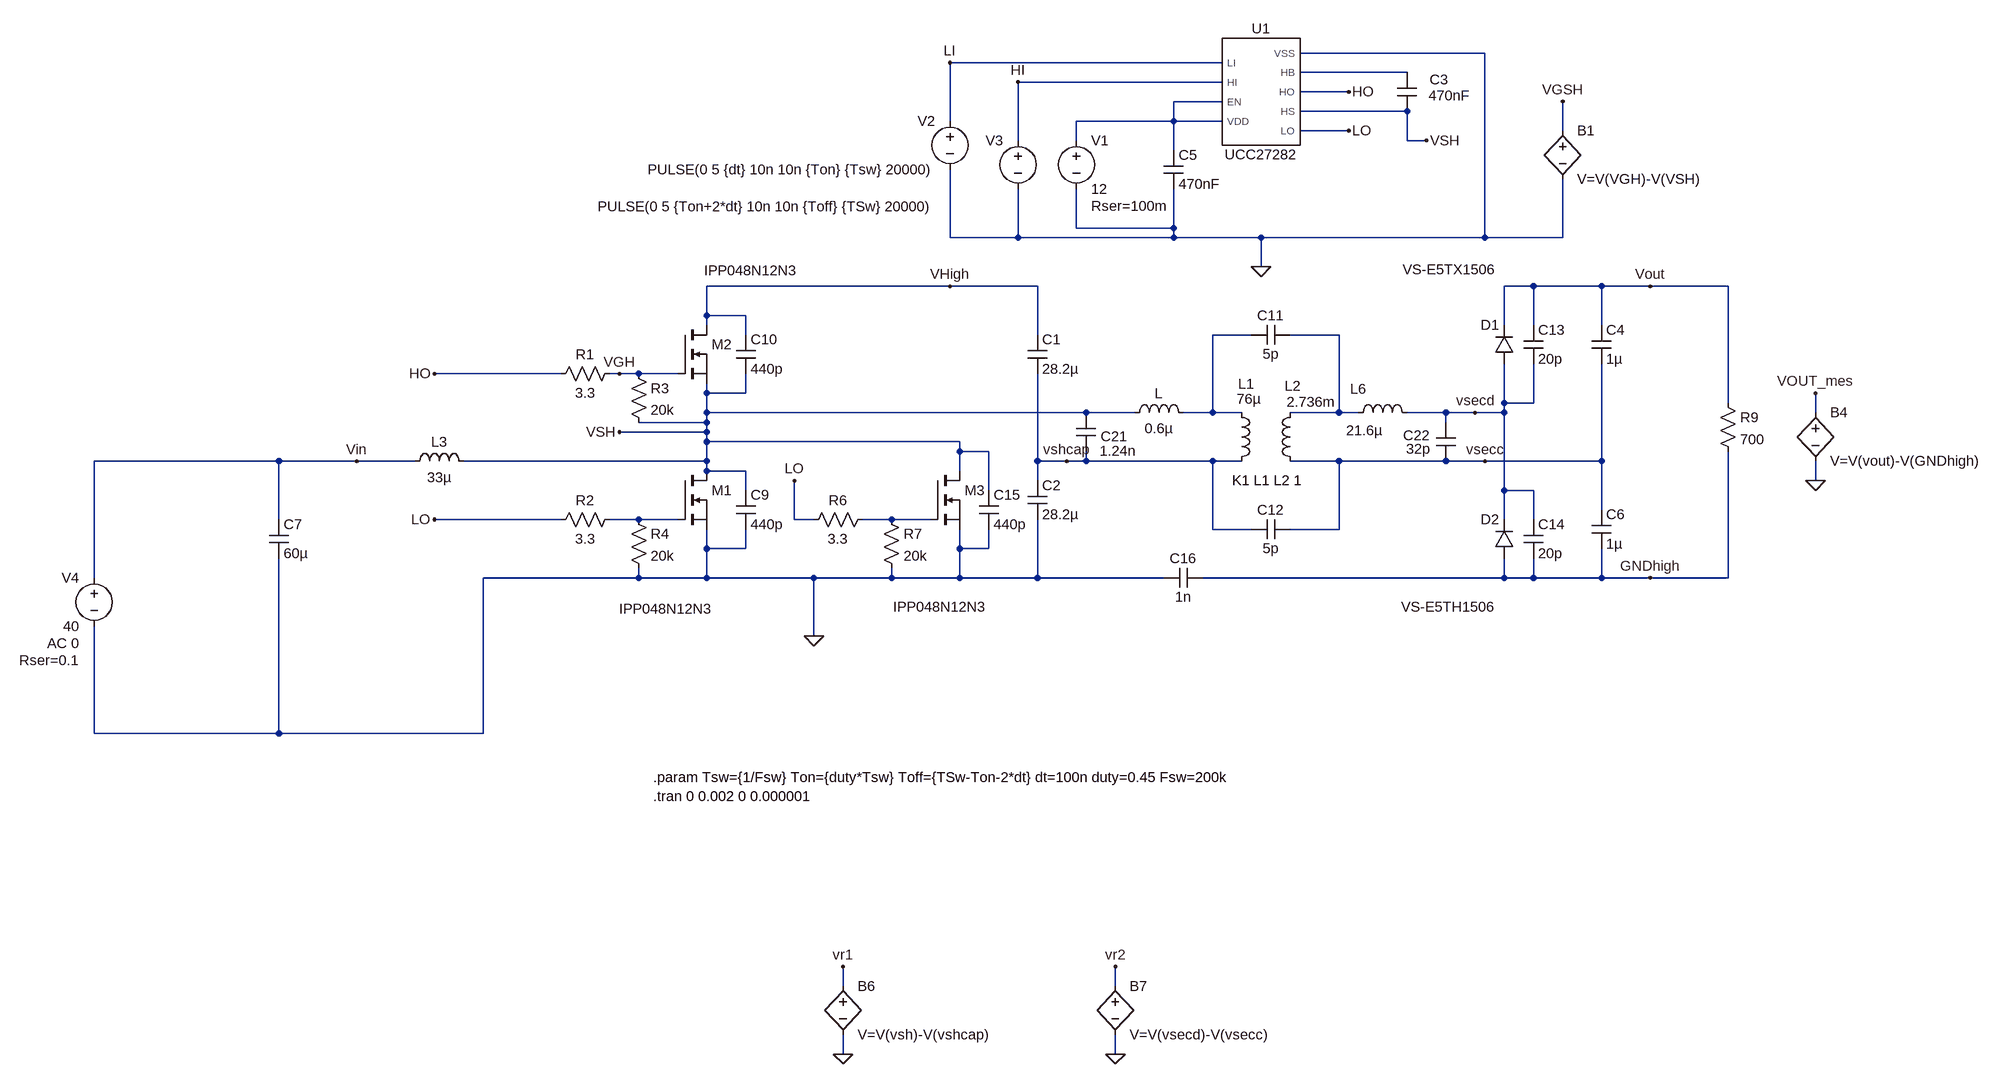
[diagram p0: schematic Current_Fed_Half_Bridge.asc]
Current_Fed_Half_Bridge.asc, the LTspice schematic file:
Version 4.1
SHEET 1 2312 1124
WIRE 1472 -544 1168 -544
WIRE 1040 -528 592 -528
WIRE 1344 -512 1168 -512
WIRE 1040 -496 704 -496
WIRE 1248 -480 1168 -480
WIRE 1040 -464 960 -464
WIRE 1344 -448 1168 -448
WIRE 592 -432 592 -528
WIRE 960 -432 960 -464
WIRE 960 -432 800 -432
WIRE 1040 -432 960 -432
WIRE 1248 -416 1168 -416
WIRE 1600 -416 1600 -464
WIRE 704 -400 704 -496
WIRE 800 -400 800 -432
WIRE 1344 -400 1344 -448
WIRE 1376 -400 1344 -400
WIRE 960 -384 960 -432
WIRE 800 -256 800 -320
WIRE 960 -256 960 -320
WIRE 960 -256 800 -256
WIRE 592 -240 592 -352
WIRE 704 -240 704 -320
WIRE 704 -240 592 -240
WIRE 960 -240 960 -256
WIRE 960 -240 704 -240
WIRE 1104 -240 960 -240
WIRE 1472 -240 1472 -544
WIRE 1472 -240 1104 -240
WIRE 1600 -240 1600 -336
WIRE 1600 -240 1472 -240
WIRE 1104 -192 1104 -240
WIRE 592 -160 192 -160
WIRE 736 -160 592 -160
WIRE 1552 -160 1504 -160
WIRE 1664 -160 1552 -160
WIRE 1744 -160 1664 -160
WIRE 1872 -160 1744 -160
WIRE 192 -112 192 -160
WIRE 256 -112 192 -112
WIRE 192 -96 192 -112
WIRE 1504 -96 1504 -160
WIRE 1552 -96 1552 -160
WIRE 1664 -96 1664 -160
WIRE 256 -80 256 -112
WIRE 736 -80 736 -160
WIRE 1088 -80 1024 -80
WIRE 1232 -80 1152 -80
WIRE -48 -16 -256 -16
WIRE 48 -16 32 -16
WIRE 80 -16 48 -16
WIRE 144 -16 80 -16
WIRE 192 16 192 0
WIRE 256 16 256 -16
WIRE 256 16 192 16
WIRE 1504 32 1504 -32
WIRE 1552 32 1552 -32
WIRE 1552 32 1504 32
WIRE 1872 32 1872 -160
WIRE 192 48 192 16
WIRE 816 48 192 48
WIRE 896 48 816 48
WIRE 1024 48 1024 -80
WIRE 1024 48 976 48
WIRE 1072 48 1024 48
WIRE 1232 48 1232 -80
WIRE 1232 48 1152 48
WIRE 1264 48 1232 48
WIRE 1408 48 1344 48
WIRE 1456 48 1408 48
WIRE 1504 48 1504 32
WIRE 1504 48 1456 48
WIRE 2016 48 2016 16
WIRE 192 64 192 48
WIRE 192 64 80 64
WIRE 1408 64 1408 48
WIRE 192 80 192 64
WIRE 192 80 48 80
WIRE 192 96 192 80
WIRE 608 96 192 96
WIRE 608 112 608 96
WIRE 656 112 608 112
WIRE -512 128 -816 128
WIRE -384 128 -512 128
WIRE -288 128 -384 128
WIRE 192 128 192 96
WIRE 192 128 -208 128
WIRE 736 128 736 -16
WIRE 784 128 736 128
WIRE 816 128 816 112
WIRE 816 128 784 128
WIRE 1024 128 816 128
WIRE 1072 128 1024 128
WIRE 1232 128 1152 128
WIRE 1408 128 1232 128
WIRE 1472 128 1408 128
WIRE 1664 128 1664 -32
WIRE 1664 128 1472 128
WIRE 192 144 192 128
WIRE 256 144 192 144
WIRE 608 144 608 112
WIRE 736 160 736 128
WIRE 2016 160 2016 128
WIRE 256 176 256 144
WIRE 656 176 656 112
WIRE 1504 176 1504 48
WIRE 1552 176 1504 176
WIRE 1664 208 1664 128
WIRE -512 224 -512 128
WIRE -48 224 -256 224
WIRE 80 224 32 224
WIRE 144 224 80 224
WIRE 336 224 336 160
WIRE 368 224 336 224
WIRE 496 224 448 224
WIRE 560 224 496 224
WIRE 1504 224 1504 176
WIRE 1552 224 1552 176
WIRE 1024 240 1024 128
WIRE 1088 240 1024 240
WIRE 1232 240 1232 128
WIRE 1232 240 1152 240
WIRE 192 272 192 240
WIRE 256 272 256 240
WIRE 256 272 192 272
WIRE 608 272 608 240
WIRE 656 272 656 240
WIRE 656 272 608 272
WIRE -816 320 -816 128
WIRE 80 320 80 304
WIRE 80 320 -176 320
WIRE 192 320 192 272
WIRE 192 320 80 320
WIRE 368 320 192 320
WIRE 496 320 496 304
WIRE 496 320 368 320
WIRE 608 320 608 272
WIRE 608 320 496 320
WIRE 736 320 736 224
WIRE 736 320 608 320
WIRE 944 320 736 320
WIRE 1504 320 1504 288
WIRE 1504 320 1008 320
WIRE 1552 320 1552 288
WIRE 1552 320 1504 320
WIRE 1664 320 1664 272
WIRE 1664 320 1552 320
WIRE 1744 320 1664 320
WIRE 1872 320 1872 112
WIRE 1872 320 1744 320
WIRE 368 416 368 320
WIRE -816 576 -816 400
WIRE -512 576 -512 288
WIRE -512 576 -816 576
WIRE -176 576 -176 320
WIRE -176 576 -512 576
WIRE 416 992 416 960
WIRE 864 992 864 960
WIRE 416 1104 416 1072
WIRE 864 1104 864 1072
FLAG 48 -16 VGH
FLAG 48 80 VSH
FLAG 1600 -464 VGSH
FLAG 1248 -480 HO
FLAG 1248 -416 LO
FLAG -256 -16 HO
FLAG -256 224 LO
FLAG 592 -160 VHigh
FLAG 1744 -160 Vout
FLAG -384 128 Vin
FLAG 1376 -400 VSH
FLAG 592 -528 LI
FLAG 704 -496 HI
FLAG 336 160 LO
FLAG 1744 320 GNDhigh
FLAG 2016 16 VOUT_mes
FLAG 2016 160 0
FLAG 416 960 vr1
FLAG 416 1104 0
FLAG 784 128 vshcap
FLAG 1456 48 vsecd
FLAG 864 960 vr2
FLAG 864 1104 0
FLAG 1472 128 vsecc
FLAG 1104 -192 0
FLAG 368 416 0
SYMBOL nmos 144 144 R0
WINDOW 3 -96 227 Left 2
SYMATTR Value IPP048N12N3
SYMATTR InstName M1
SYMBOL nmos 144 -96 R0
WINDOW 3 44 -90 Left 2
SYMATTR Value IPP048N12N3
SYMATTR InstName M2
SYMBOL res 48 -32 R90
WINDOW 0 0 56 VBottom 2
WINDOW 3 32 56 VTop 2
SYMATTR InstName R1
SYMATTR Value 3.3
SYMBOL res 48 208 R90
WINDOW 0 0 56 VBottom 2
WINDOW 3 32 56 VTop 2
SYMATTR InstName R2
SYMATTR Value 3.3
SYMBOL cap 720 -80 R0
SYMATTR InstName C1
SYMATTR Value 28.2µ
SYMBOL cap 720 160 R0
SYMATTR InstName C2
SYMATTR Value 28.2µ
SYMBOL res 64 -32 R0
SYMATTR InstName R3
SYMATTR Value 20k
SYMBOL res 64 208 R0
SYMATTR InstName R4
SYMATTR Value 20k
SYMBOL cap 1328 -512 R0
WINDOW 0 53 12 Left 2
WINDOW 3 52 38 Left 2
SYMATTR InstName C3
SYMATTR Value 470nF
SYMATTR SpiceLine V=100
SYMBOL cap 944 -384 R0
SYMATTR InstName C5
SYMATTR Value 470nF
SYMATTR SpiceLine V=100
SYMBOL voltage 800 -416 R0
WINDOW 123 0 0 Left 0
WINDOW 39 24 124 Left 2
SYMATTR SpiceLine Rser=100m
SYMATTR InstName V1
SYMATTR Value 12
SYMBOL ind 1056 144 M180
WINDOW 0 10 143 Left 2
WINDOW 3 8 118 Left 2
SYMATTR InstName L1
SYMATTR Value 76µ
SYMATTR Type ind
SYMATTR SpiceLine Rser=1m
SYMBOL ind 1168 144 R180
WINDOW 0 -2 140 Left 2
WINDOW 3 -59 113 Left 2
SYMATTR InstName L2
SYMATTR Value 2.736m
SYMATTR Type ind
SYMATTR SpiceLine Rser=1m
SYMBOL diode 1520 -32 R180
WINDOW 0 24 64 Left 2
WINDOW 3 29 155 Left 2
SYMATTR InstName D1
SYMATTR Value VS-E5TX1506
SYMBOL cap 1648 -96 R0
SYMATTR InstName C4
SYMATTR Value 1µ
SYMBOL cap 1648 208 R0
SYMATTR InstName C6
SYMATTR Value 1µ
SYMBOL diode 1520 288 R180
WINDOW 0 24 64 Left 2
WINDOW 3 30 -80 Left 2
SYMATTR InstName D2
SYMATTR Value VS-E5TH1506
SYMBOL voltage 592 -448 M0
WINDOW 123 0 0 Left 0
WINDOW 39 0 0 Left 0
SYMATTR InstName V2
SYMATTR Value PULSE(0 5 {dt} 10n 10n {Ton} {Tsw} 20000)
SYMBOL voltage 704 -416 M0
WINDOW 3 136 125 Left 2
WINDOW 123 0 0 Left 0
WINDOW 39 0 0 Left 0
SYMATTR Value PULSE(0 5 {Ton+2*dt} 10n 10n {Toff} {TSw} 20000)
SYMATTR InstName V3
SYMBOL ind -304 144 R270
WINDOW 0 32 56 VTop 2
WINDOW 3 5 56 VBottom 2
SYMATTR InstName L3
SYMATTR Value 33µ
SYMATTR SpiceLine Rser=1m
SYMBOL cap -528 224 R0
SYMATTR InstName C7
SYMATTR Value 60µ
SYMBOL voltage -816 304 M0
WINDOW 123 24 124 Left 2
WINDOW 39 24 152 Left 2
SYMATTR Value2 AC 0
SYMATTR SpiceLine Rser=0.1
SYMATTR InstName V4
SYMATTR Value 40
SYMBOL bv 1600 -432 R0
SYMATTR InstName B1
SYMATTR Value V=V(VGH)-V(VSH)
SYMBOL nmos 560 144 R0
WINDOW 3 -61 224 Left 2
SYMATTR Value IPP048N12N3
SYMATTR InstName M3
SYMBOL res 464 208 R90
WINDOW 0 0 56 VBottom 2
WINDOW 3 32 56 VTop 2
SYMATTR InstName R6
SYMATTR Value 3.3
SYMBOL res 480 208 R0
SYMATTR InstName R7
SYMATTR Value 20k
SYMBOL cap 240 176 R0
SYMATTR InstName C9
SYMATTR Value 440p
SYMBOL cap 240 -80 R0
SYMATTR InstName C10
SYMATTR Value 440p
SYMBOL cap 1152 -96 R90
WINDOW 0 0 32 VBottom 2
WINDOW 3 32 32 VTop 2
SYMATTR InstName C11
SYMATTR Value 5p
SYMBOL cap 1152 224 R90
WINDOW 0 0 32 VBottom 2
WINDOW 3 32 32 VTop 2
SYMATTR InstName C12
SYMATTR Value 5p
SYMBOL cap 640 176 R0
SYMATTR InstName C15
SYMATTR Value 440p
SYMBOL cap 1008 304 R90
WINDOW 0 0 32 VBottom 2
WINDOW 3 32 32 VTop 2
SYMATTR InstName C16
SYMATTR Value 1n
SYMBOL res 1856 16 R0
SYMATTR InstName R9
SYMATTR Value 700
SYMBOL bv 2016 32 R0
SYMATTR InstName B4
SYMATTR Value V=V(vout)-V(GNDhigh)
SYMBOL lib\\JAL\\UCC27282 1104 -480 R0
SYMATTR InstName U1
SYMBOL ind 880 64 R270
WINDOW 0 32 56 VTop 2
WINDOW 3 5 56 VBottom 2
SYMATTR InstName L
SYMATTR Value 0.6µ
SYMATTR SpiceLine Rser=5.6m
SYMBOL bv 416 976 R0
SYMATTR InstName B6
SYMATTR Value V=V(vsh)-V(vshcap)
SYMBOL bv 864 976 R0
SYMATTR InstName B7
SYMATTR Value V=V(vsecd)-V(vsecc)
SYMBOL cap 1536 -96 R0
SYMATTR InstName C13
SYMATTR Value 20p
SYMBOL cap 1536 224 R0
SYMATTR InstName C14
SYMATTR Value 20p
SYMBOL ind 1248 64 R270
WINDOW 0 39 16 VTop 2
WINDOW 3 2 26 VBottom 2
SYMATTR InstName L6
SYMATTR Value 21.6µ
SYMATTR SpiceLine Rser=28.5m
SYMBOL cap 800 48 R0
WINDOW 0 40 39 Left 2
WINDOW 3 38 63 Left 2
SYMATTR InstName C21
SYMATTR Value 1.24n
SYMBOL cap 1424 64 M0
WINDOW 0 42 22 Left 2
WINDOW 3 41 44 Left 2
SYMATTR InstName C22
SYMATTR Value 32p
TEXT 1056 160 Left 2 !K1 L1 L2 1
TEXT 104 680 Left 2 !.tran 0 0.002 0 0.000001
TEXT 104 648 Left 2 !.param Tsw={1/Fsw} Ton={duty*Tsw} Toff={TSw-Ton-2*dt} dt=100n duty=0.45 Fsw=200k

The netlist it stands for:
* Current_Fed_Half_Bridge.asc
M1 VSH N005 0 0 IPP048N12N3
M2 VHigh VGH VSH VSH IPP048N12N3
R1 VGH HO 3.3
R2 N005 LO 3.3
C1 VHigh vshcap 28.2µ
C2 vshcap 0 28.2µ
R3 VGH VSH 20k
R4 N005 0 20k
C3 N001 VSH 470nF V=100
C5 N002 0 470nF V=100
V1 N002 0 12 Rser=100m
L1 vshcap N003 76µ Rser=1m
L2 vsecc N004 2.736m Rser=1m
D1 vsecd Vout VS-E5TX1506
C4 Vout vsecc 1µ
C6 vsecc GNDhigh 1µ
D2 GNDhigh vsecd VS-E5TH1506
V2 LI 0 PULSE(0 5 {dt} 10n 10n {Ton} {Tsw} 20000)
V3 HI 0 PULSE(0 5 {Ton+2*dt} 10n 10n {Toff} {TSw} 20000)
L3 Vin VSH 33µ Rser=1m
C7 Vin 0 60µ
V4 Vin 0 40 AC 0 Rser=0.1
B1 VGSH 0 V=V(VGH)-V(VSH)
M3 VSH N006 0 0 IPP048N12N3
R6 N006 LO 3.3
R7 N006 0 20k
C9 VSH 0 440p
C10 VHigh VSH 440p
C11 N004 N003 5p
C12 vsecc vshcap 5p
C15 VSH 0 440p
C16 GNDhigh 0 1n
R9 Vout GNDhigh 700
B4 VOUT_mes 0 V=V(vout)-V(GNDhigh)
X§U1 LI HI N002 N002 0 N001 HO VSH LO UCC27282  ; pins LI HI EN VDD VSS HB HO HS LO
L VSH N003 0.6µ Rser=5.6m
B6 vr1 0 V=V(vsh)-V(vshcap)
B7 vr2 0 V=V(vsecd)-V(vsecc)
C13 Vout vsecd 20p
C14 vsecd GNDhigh 20p
L6 N004 vsecd 21.6µ Rser=28.5m
C21 VSH vshcap 1.24n
C22 vsecd vsecc 32p
.model D D
.lib standard.dio
.model NMOS NMOS
.model PMOS PMOS
.lib standard.mos
K1 L1 L2 1
.tran 0 0.002 0 0.000001
.param Tsw={1/Fsw} Ton={duty*Tsw} Toff={TSw-Ton-2*dt} dt=100n duty=0.45 Fsw=200k
.lib ucc27282.lib
.backanno
.end